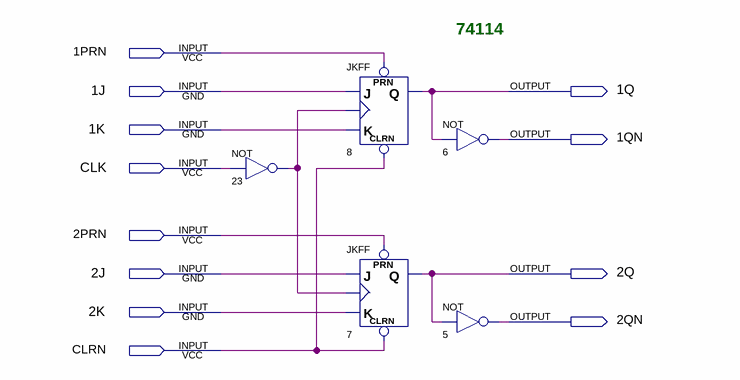
[diagram p0: schematic sheet]
// Quartus schematic 74114.bdf as structural Verilog: 5 symbols, 12 pins
module \74114  (
  input  \1PRN ,
  input  \1J ,
  input  \1K ,
  input  CLK,
  input  \2PRN ,
  input  \2J ,
  input  \2K ,
  input  CLRN,
  output \1Q ,
  output \1QN ,
  output \2Q ,
  output \2QN 
);

  wire n23_out;

  not u_23 (n23_out, CLK);
  JKFF u_8 (.PRN(\1PRN ), .CLRN(CLRN), .K(\1K ), .J(\1J ), .CLK(n23_out), .Q(\1Q ));
  JKFF u_7 (.PRN(\2PRN ), .CLRN(CLRN), .K(\2K ), .J(\2J ), .CLK(n23_out), .Q(\2Q ));
  not u_6 (\1QN , \1Q );
  not u_5 (\2QN , \2Q );

  // Notes on the sheet:
  //   74114
endmodule
